# EAGLE design SNES-Adapter-Board (EAGLE 6.1)
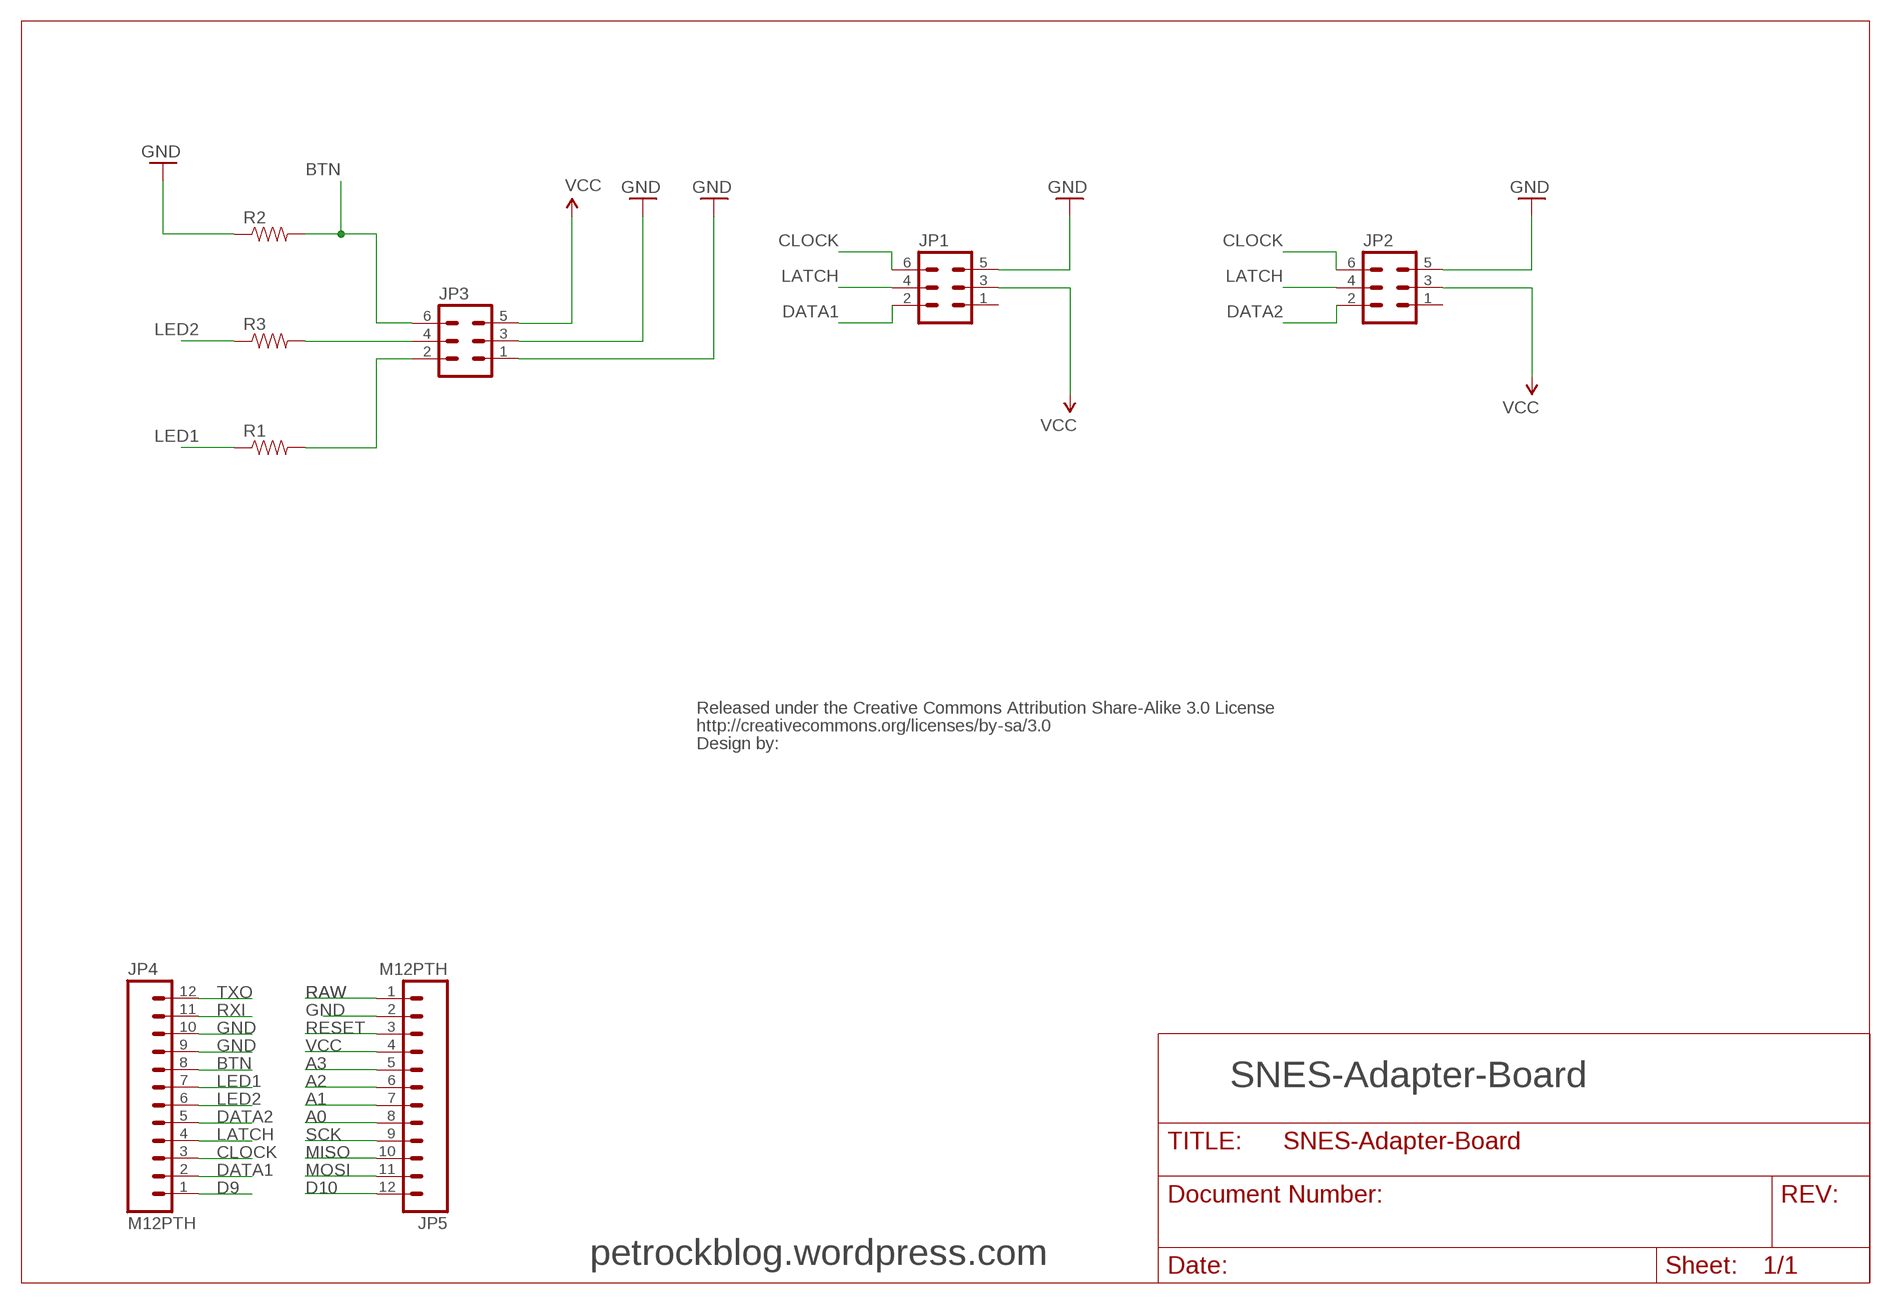
[diagram p0: schematic, sheet 1]

## Parts
JP1  ML6  [ML6]
JP2  ML6  [ML6]
JP3  ML6  [ML6]
JP4  M12PTH  [1X12]
JP5  M12PTH  [1X12]
R1  RESISTORPTH-1/4W  [AXIAL-0.4]
R2  RESISTORPTH-1/4W  [AXIAL-0.4]
R3  RESISTORPTH-1/4W  [AXIAL-0.4]
U$2  CREATIVE_COMMONS  [CREATIVE_COMMONS]

## Nets
A0: JP5.8
A1: JP5.7
A2: JP5.6
A3: JP5.5
BTN: JP3.6 JP4.8 R2.P$2
CLOCK: JP1.6 JP2.6 JP4.3
D9: JP4.1
D10: JP5.12
DATA1: JP1.2 JP4.2
DATA2: JP2.2 JP4.5
GND: JP1.5 JP2.5 JP3.1 JP3.3 JP4.9 JP4.10 JP5.2 R2.P$1
LATCH: JP1.4 JP2.4 JP4.4
LED1: JP4.7 R1.P$1
LED2: JP4.6 R3.P$1
MISO: JP5.10
MOSI: JP5.11
N$1: JP3.2 R1.P$2
N$2: JP3.4 R3.P$2
RAW: JP5.1
RESET: JP5.3
RXI: JP4.11
SCK: JP5.9
TXO: JP4.12
VCC: JP1.3 JP2.3 JP3.5 JP5.4
Unconnected: JP1.1 JP2.1

## Notes on the sheet
- SNES-Adapter-Board
- petrockblog.wordpress.com

## Library data of the parts
JP1-JP3 = con-ml:ML6: HARTING; OC_FARNELL: unknown; OC_NEWARK: unknown
JP4 JP5 = SparkFun:M12: Header 12 Standard 12-pin 0.1" header. Use with straight break away headers (SKU : PRT-00116), right angle break away headers (PRT-00553), swiss pins (PRT-00743), machine pins (PRT-00117), and female headers (PRT-00115).
R1-R3 = SparkFun:RESISTOR: Resistor Basic schematic elements and footprints for 0603, 1206, and PTH resistors.
U$2 = SparkFun-Aesthetics:CREATIVE_COMMONS: Creative Commons License summary

## Board
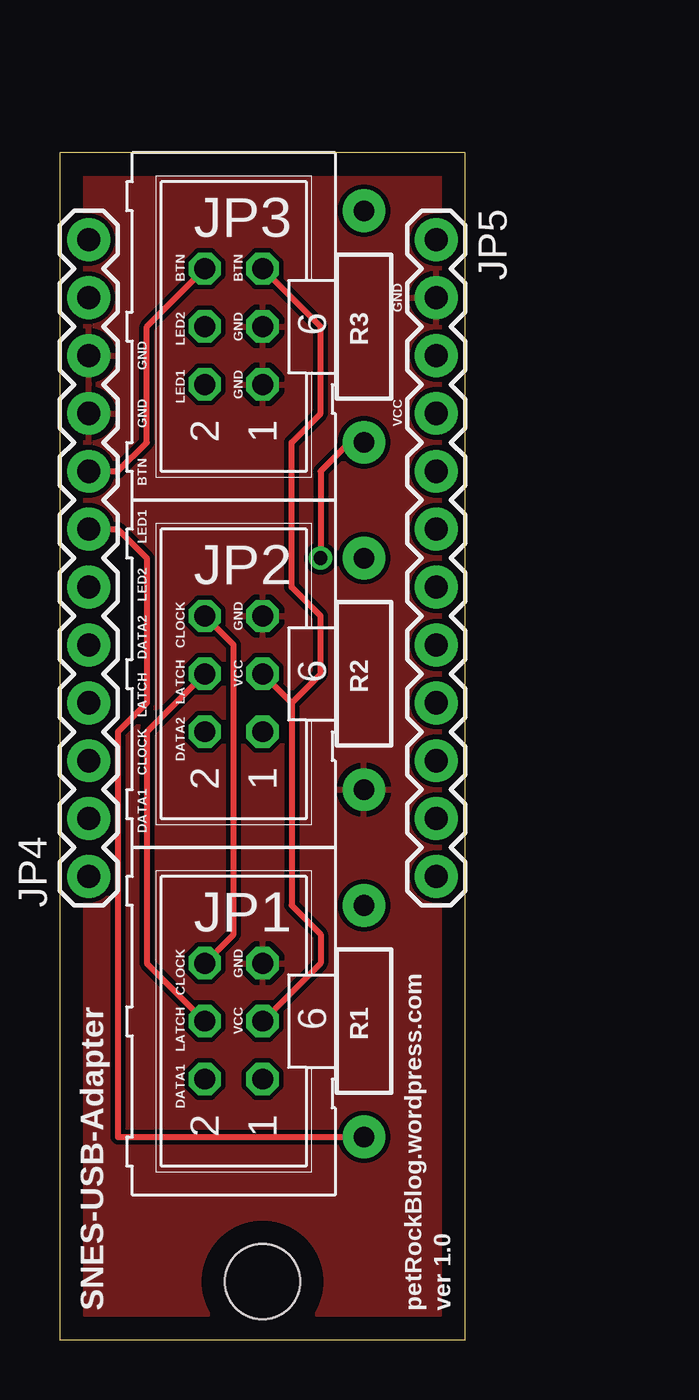
[diagram p1: board, top side]
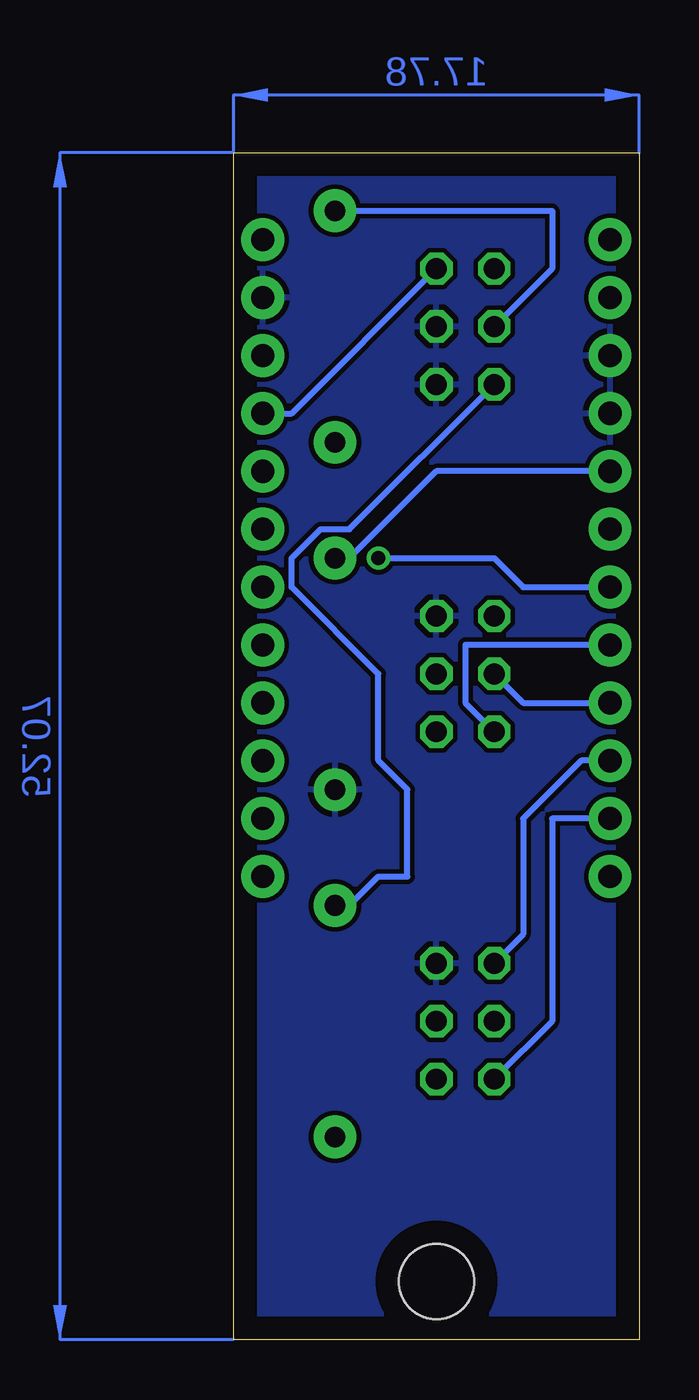
[diagram p2: board, bottom side, seen from below]

Size 17.78 x 52.07 mm. Coordinates in mm from the lower left corner, seen from the top.
Outline: 0,0 17.78,0 17.78,52.07 0,52.07 0,0
Copper layers (1*16): Top 0.035mm / dielectric 1.5mm / Bottom 0.035mm
Design rules: minimum track width 10mil, minimum drill 24mil, track to track 8mil, track to pad 8mil, pad to pad 8mil, via to via 8mil, smd to smd 8mil, copper to edge 40mil, drill to drill 8mil, minimum pad ring 10mil, minimum via ring 8mil, stop-mask expansion 4mil, vias tented up to drill 0mil, thermal gap 10mil

### Footprints (pad centres in the part's own frame; a part is rotated, then mirrored left to right if it is on the bottom)
ML6 = drill 0.914 octagon: 1 -2.54,-1.27; 2 -2.54,1.27; 3 0,-1.27; 4 0,1.27; 5 2.54,-1.27; 6 2.54,1.27
1X12 = drill 1.016 pad 1.88: 1 0,0; 2 2.54,0; 3 5.08,0; 4 7.62,0; 5 10.16,0; 6 12.7,0; 7 15.24,0; 8 17.78,0; 9 20.32,0; 10 22.86,0; 11 25.4,0; 12 27.94,0
AXIAL-0.4 = drill 0.9 pad 1.88: P$1 -5.08,0; P$2 5.08,0
STAND-OFF = hole 3.302: 0,0

### Placement (x,y rotation side)
JP1  7.62,13.97 90 top
JP2  7.62,29.21 90 top
JP3  7.62,44.45 90 top
JP4  1.27,20.32 90 top
JP5  16.51,48.26 270 top
R1  13.34,13.97 90 top
R2  13.34,29.21 90 top
R3  13.34,44.45 90 top
U$1  [STAND-OFF]  8.89,2.54 0 top
U$2  19.05,-8.89 0 top  (outside the outline)

### Tracks (layer width: path | path; a pad name or v marks a point on that pad's centre or on a via)
BTN
  Top 0.254: JP3.6 3.81,44.45 3.81,39.37 2.54,38.1 JP4.8
  Bottom 0.254: JP4.8 8.89,38.1 12.7,34.29 R2.P$2
CLOCK
  Top 0.254: JP2.6 7.62,30.48 7.62,17.78 JP1.6
  Bottom 0.254: JP1.6 5.08,17.78 5.08,22.86 2.54,25.4 JP4.3
DATA1
  Bottom 0.254: JP1.2 3.81,13.97 3.81,22.86 JP4.2
DATA2
  Bottom 0.254: JP2.2 7.62,27.94 7.62,30.48 JP4.5
GND
  pour Top: 0,52.07 17.78,52.07 17.78,0 0,0
  pour Bottom: 0,52.07 17.78,52.07 17.78,0 0,0
LATCH
  Top 0.254: JP1.4 3.81,16.51 3.81,26.67 JP2.4
  Bottom 0.254: JP4.4 5.08,27.94 JP2.4
LED1
  Top 0.254: R1.P$1 2.54,8.89 2.54,26.67 3.81,27.94 3.81,34.29 2.54,35.56 JP4.7
LED2  (via drill 0.61)
  Top 0.254: v11.43,34.29 11.43,38.1 12.7,39.37 R3.P$1
  Bottom 0.254: JP4.6 5.08,33.02 6.35,34.29 v11.43,34.29
N$1
  Bottom 0.254: JP3.2 12.7,35.56 13.97,35.56 15.24,34.29 15.24,33.02 11.43,29.21 11.43,25.4 10.16,24.13 10.16,20.32 11.43,20.32 12.7,19.05 R1.P$2
N$2
  Bottom 0.254: JP3.4 3.81,46.99 3.81,49.53 R3.P$2
VCC
  Top 0.254: JP1.3 11.43,16.51 11.43,17.78 10.16,19.05 10.16,27.94 | JP2.3 10.16,27.94 | JP3.5 11.43,44.45 11.43,40.64 10.16,39.37 10.16,33.02 11.43,31.75 11.43,29.21 10.16,27.94
  Bottom 0.254: JP3.5 15.24,40.64 JP5.4
(copper drawn outside any net)
  shapes: Bottom area x2

### Text on the board
tPlace: BTN | BTN | GND | LED2 | GND | GND | LED1 | GND | VCC | GND | BTN | LED1 | LED2 | CLOCK | GND | DATA2 | LATCH | VCC | LATCH | DATA2 | CLOCK | DATA1 | CLOCK | GND | LATCH | VCC | DATA1 | SNES-USB-Adapter | petRockBlog.wordpress.com | ver 1.0